# Altium schematic sheet BLOCK-DIAGRAM.SchDoc
size A1
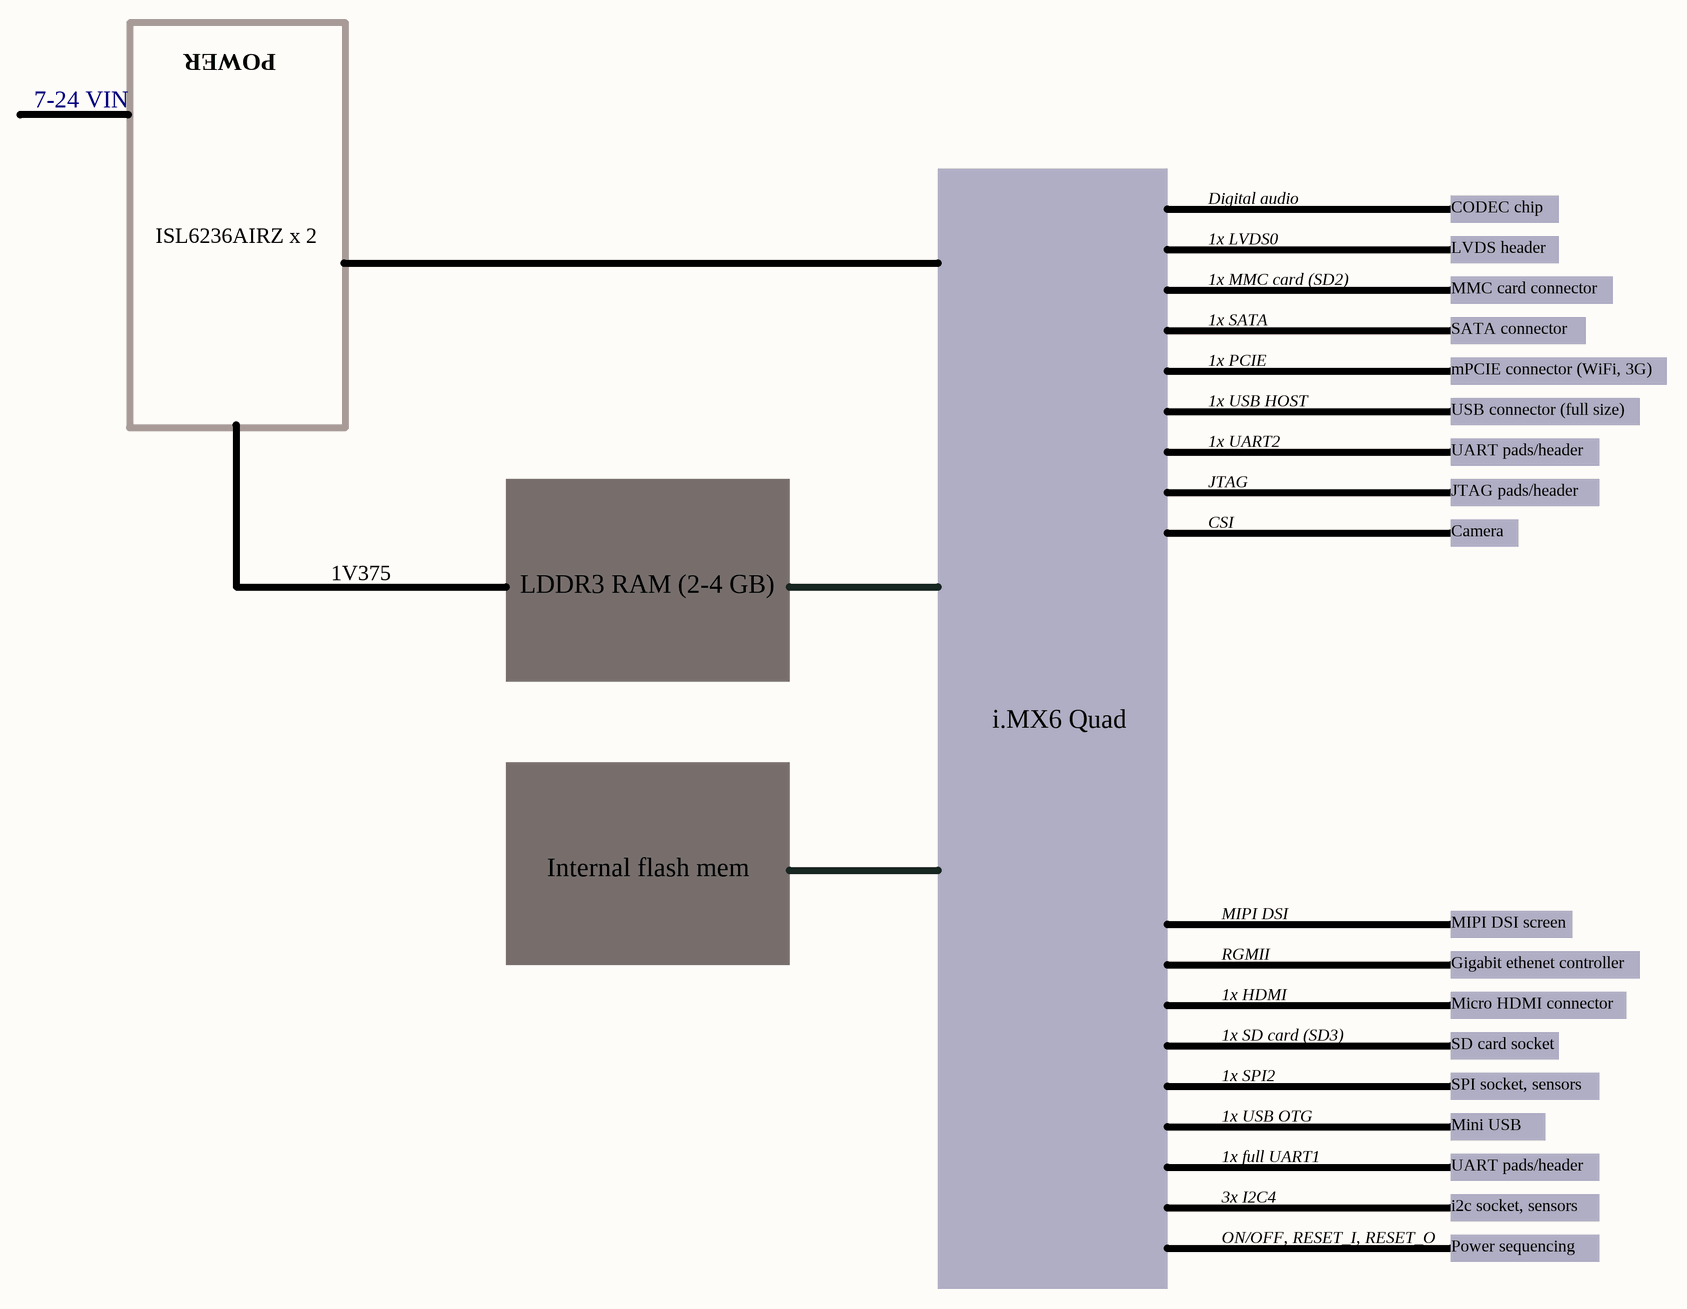
[diagram p0: BLOCK-DIAGRAM.SchDoc]

## Notes on the sheet
- POWER
- 7-24 VIN
- Digital audio
- CODEC chip
- ISL6236AIRZ x 2
- 1x LVDS0
- 1x MMC card (SD2)
- LVDS header
- MMC card connector
- 1x SATA
- 1x PCIE
- SATA connector
- 1x USB HOST
- mPCIE connector (WiFi, 3G)
- USB connector (full size)
- 1x UART2
- JTAG
- UART pads/header
- JTAG pads/header
- CSI
- Camera
- 1V375
- LDDR3 RAM (2-4 GB)
- i.MX6 Quad
- Internal flash mem
- RGMII
- MIPI DSI
- Gigabit ethenet controller
- MIPI DSI screen
- ETHERNET PHY
- 1x HDMI
- 1x SD card (SD3)
- Micro HDMI connector
- (10/100/1000 Mbps)
- 1x SPI2
- SD card socket
- SPI socket, sensors
- 1x USB OTG
- 1x full UART1
- Mini USB
- 3x I2C4
- ON/OFF, RESET_I, RESET_O
- i2c socket, sensors
- Power sequencing